# EAGLE schematic dsp (EAGLE 6.6.0)

## Sheet 1 of 2
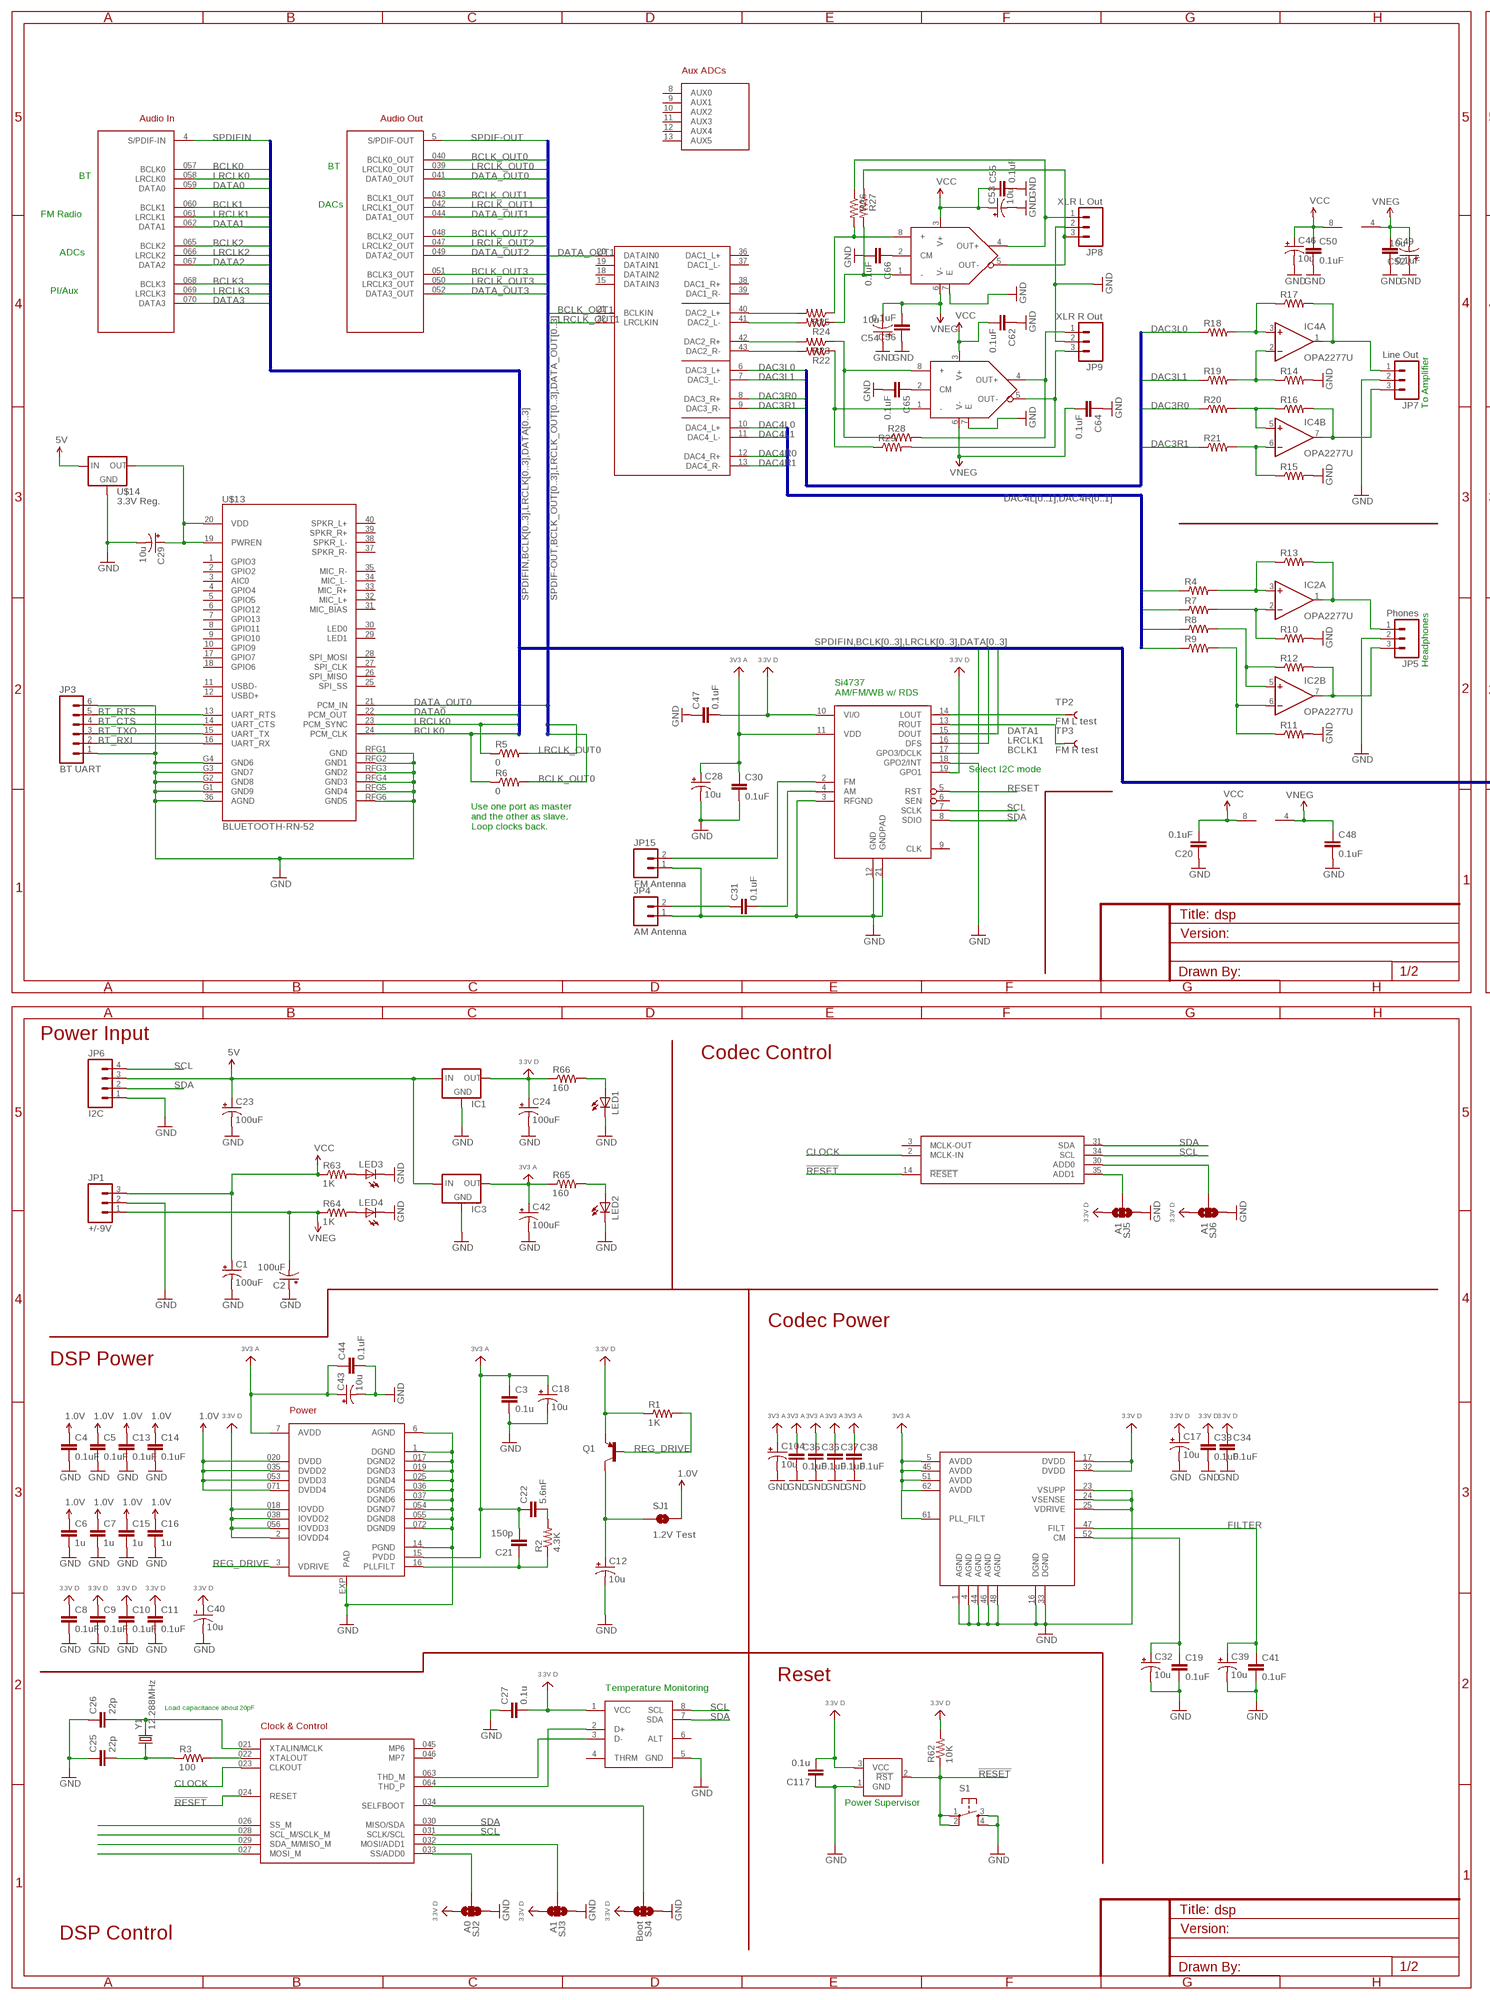
[diagram p0: schematic, sheet 1, part 1 of 2]
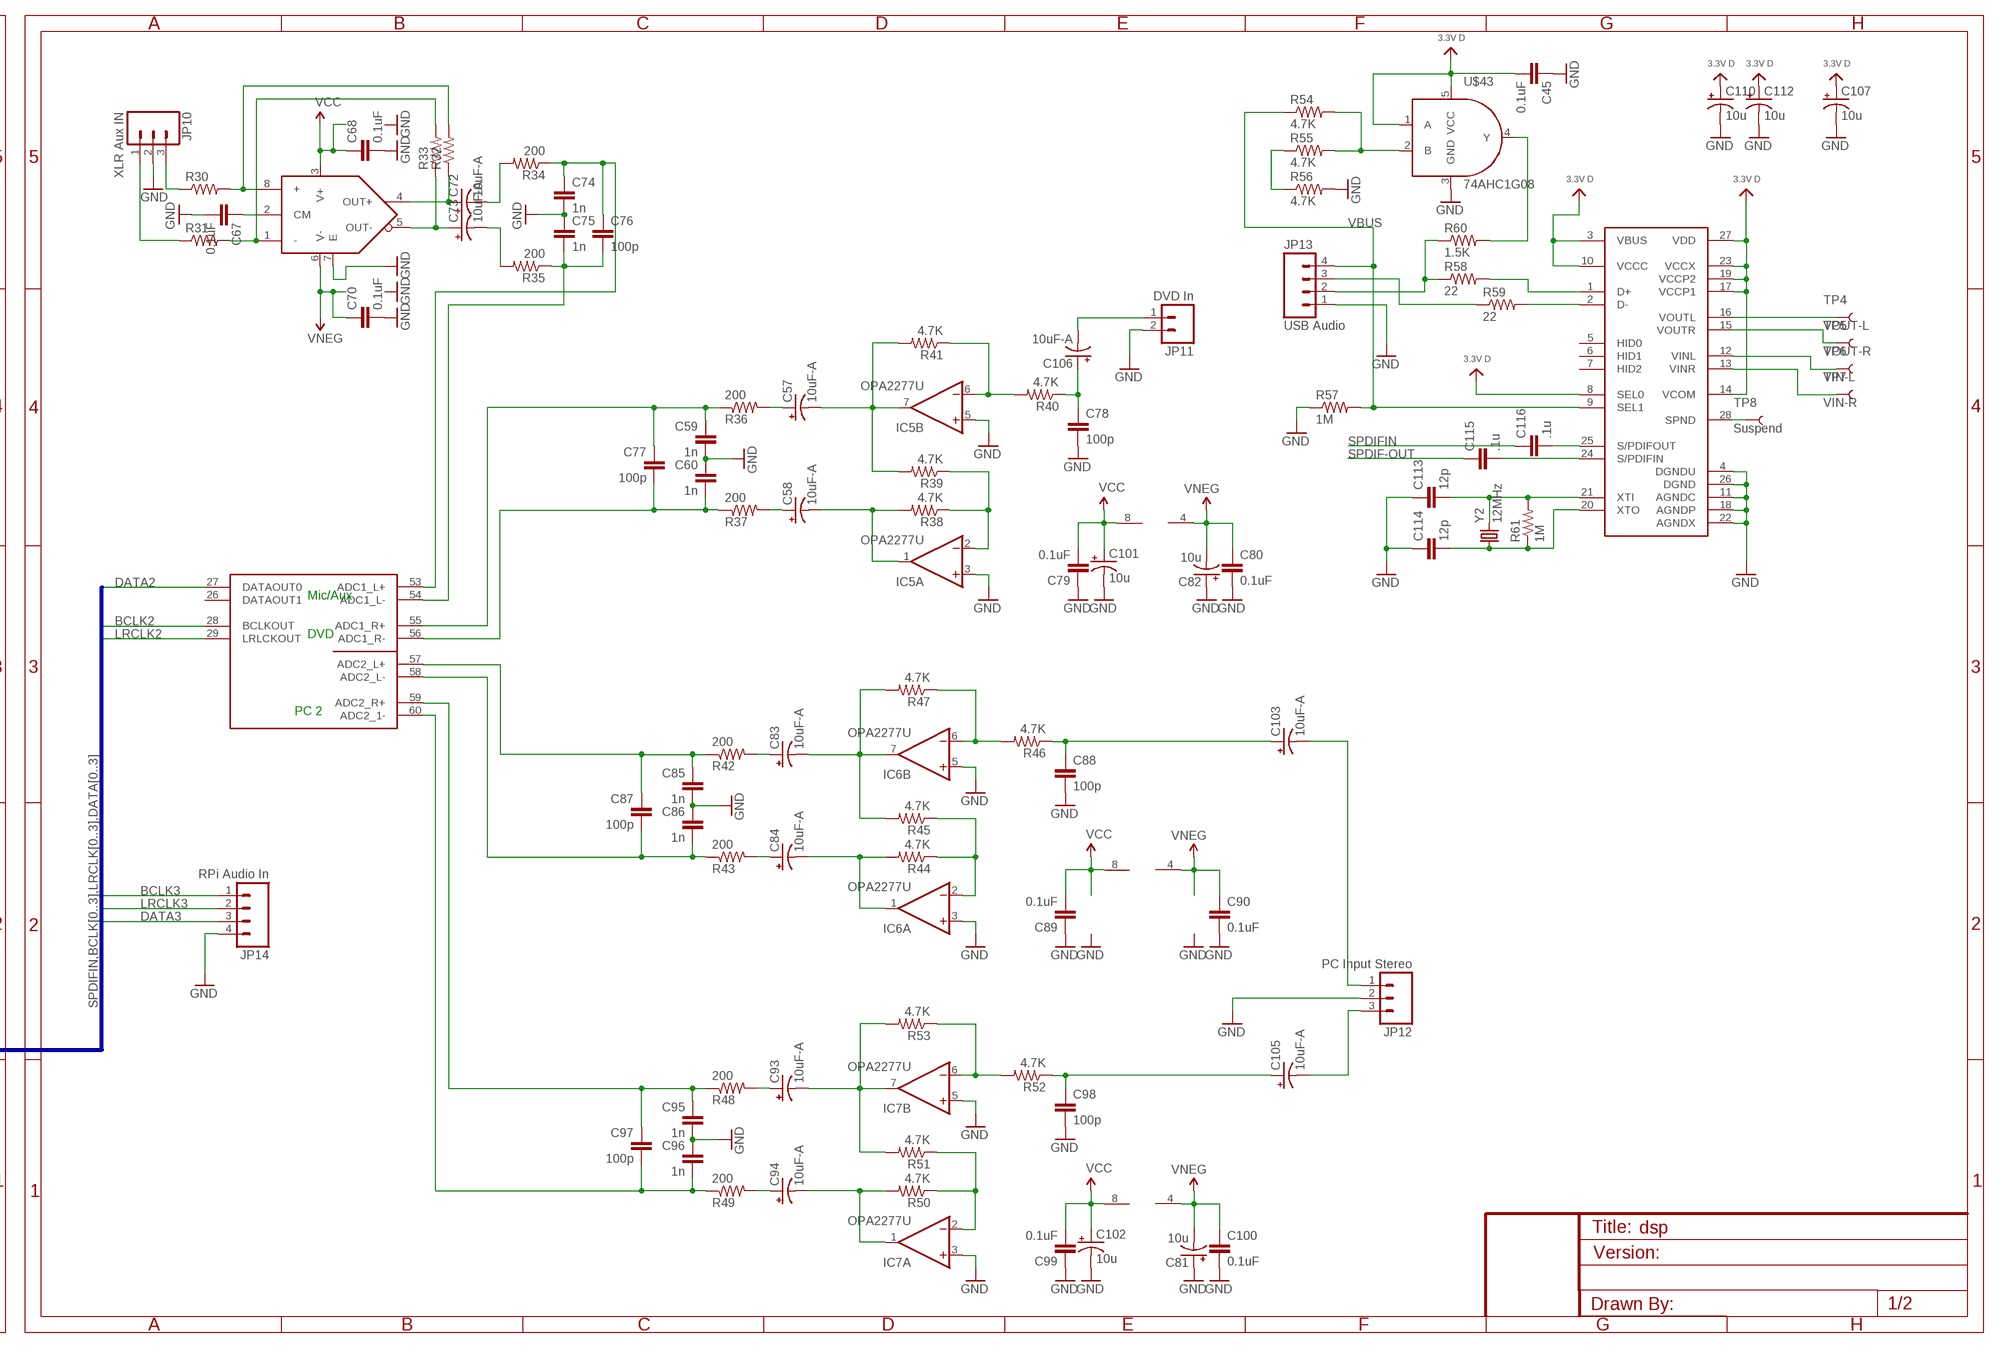
[diagram p1: schematic, sheet 1, part 2 of 2]

### Parts
C1  100uF  CAP_POLPTH1  [CPOL-RADIAL-100UF-25V]
C2  100uF  CAP_POLPTH1  [CPOL-RADIAL-100UF-25V]
C3  0.1u  CAP0603-CAP  [0603-CAP]
C4  0.1uF  CAP0603-CAP  [0603-CAP]
C5  0.1uF  CAP0603-CAP  [0603-CAP]
C6  1u  CAP0603-CAP  [0603-CAP]
C7  1u  CAP0603-CAP  [0603-CAP]
C8  0.1uF  CAP0603-CAP  [0603-CAP]
C9  0.1uF  CAP0603-CAP  [0603-CAP]
C10  0.1uF  CAP0603-CAP  [0603-CAP]
C11  0.1uF  CAP0603-CAP  [0603-CAP]
C12  10u  CPOL-USB  [PANASONIC_B]
C13  0.1uF  CAP0603-CAP  [0603-CAP]
C14  0.1uF  CAP0603-CAP  [0603-CAP]
C15  1u  CAP0603-CAP  [0603-CAP]
C16  1u  CAP0603-CAP  [0603-CAP]
C17  10u  CPOL-USB  [PANASONIC_B]
C18  10u  CPOL-USB  [PANASONIC_B]
C19  0.1uF  CAP0603-CAP  [0603-CAP]
C20  0.1uF  CAP0603-CAP  [0603-CAP]
C21  150p  CAP0603-CAP  [0603-CAP]
C22  5.6nF  CAP0603-CAP  [0603-CAP]
C23  100uF  CAP_POLPTH1  [CPOL-RADIAL-100UF-25V]
C24  100uF  CAP_POLPTH1  [CPOL-RADIAL-100UF-25V]
C25  22p  CAP0603-CAP  [0603-CAP]
C26  22p  CAP0603-CAP  [0603-CAP]
C27  0.1u  CAP0603-CAP  [0603-CAP]
C28  10u  CPOL-USB  [PANASONIC_B]
C29  10u  CPOL-USB  [PANASONIC_B]
C30  0.1uF  CAP0603-CAP  [0603-CAP]
C31  0.1uF  CAP0603-CAP  [0603-CAP]
C32  10u  CPOL-USB  [PANASONIC_B]
C33  0.1uF  CAP0603-CAP  [0603-CAP]
C34  0.1uF  CAP0603-CAP  [0603-CAP]
C35  0.1uF  CAP0603-CAP  [0603-CAP]
C36  0.1uF  CAP0603-CAP  [0603-CAP]
C37  0.1uF  CAP0603-CAP  [0603-CAP]
C38  0.1uF  CAP0603-CAP  [0603-CAP]
C39  10u  CPOL-USB  [PANASONIC_B]
C40  10u  CPOL-USB  [PANASONIC_B]
C41  0.1uF  CAP0603-CAP  [0603-CAP]
C42  100uF  CAP_POLPTH1  [CPOL-RADIAL-100UF-25V]
C43  10u  CPOL-USB  [PANASONIC_B]
C44  0.1uF  CAP0603-CAP  [0603-CAP]
C45  0.1uF  CAP0603-CAP  [0603-CAP]
C46  10u  CPOL-USB  [PANASONIC_B]
C47  0.1uF  CAP0603-CAP  [0603-CAP]
C48  0.1uF  CAP0603-CAP  [0603-CAP]
C49  0.1uF  CAP0603-CAP  [0603-CAP]
C50  0.1uF  CAP0603-CAP  [0603-CAP]
C52  10u  CPOL-USB  [PANASONIC_B]
C53  10u  CPOL-USB  [PANASONIC_B]
C54  10u  CPOL-USB  [PANASONIC_B]
C55  0.1uF  CAP0603-CAP  [0603-CAP]
C56  0.1uF  CAP0603-CAP  [0603-CAP]
C57  10uF-A  CAP_POLC  [PANASONIC_C]
C58  10uF-A  CAP_POLC  [PANASONIC_C]
C59  1n  CAP0603-CAP  [0603-CAP]
C60  1n  CAP0603-CAP  [0603-CAP]
C62  0.1uF  CAP0603-CAP  [0603-CAP]
C64  0.1uF  CAP0603-CAP  [0603-CAP]
C65  0.1uF  CAP0603-CAP  [0603-CAP]
C66  0.1uF  CAP0603-CAP  [0603-CAP]
C67  0.1uF  CAP0603-CAP  [0603-CAP]
C68  0.1uF  CAP0603-CAP  [0603-CAP]
C70  0.1uF  CAP0603-CAP  [0603-CAP]
C72  10uF-A  CAP_POLC  [PANASONIC_C]
C73  10uF-A  CAP_POLC  [PANASONIC_C]
C74  1n  CAP0603-CAP  [0603-CAP]
C75  1n  CAP0603-CAP  [0603-CAP]
C76  100p  CAP0603-CAP  [0603-CAP]
C77  100p  CAP0603-CAP  [0603-CAP]
C78  100p  CAP0603-CAP  [0603-CAP]
C79  0.1uF  CAP0603-CAP  [0603-CAP]
C80  0.1uF  CAP0603-CAP  [0603-CAP]
C81  10u  CPOL-USB  [PANASONIC_B]
C82  10u  CPOL-USB  [PANASONIC_B]
C83  10uF-A  CAP_POLC  [PANASONIC_C]
C84  10uF-A  CAP_POLC  [PANASONIC_C]
C85  1n  CAP0603-CAP  [0603-CAP]
C86  1n  CAP0603-CAP  [0603-CAP]
C87  100p  CAP0603-CAP  [0603-CAP]
C88  100p  CAP0603-CAP  [0603-CAP]
C89  0.1uF  CAP0603-CAP  [0603-CAP]
C90  0.1uF  CAP0603-CAP  [0603-CAP]
C93  10uF-A  CAP_POLC  [PANASONIC_C]
C94  10uF-A  CAP_POLC  [PANASONIC_C]
C95  1n  CAP0603-CAP  [0603-CAP]
C96  1n  CAP0603-CAP  [0603-CAP]
C97  100p  CAP0603-CAP  [0603-CAP]
C98  100p  CAP0603-CAP  [0603-CAP]
C99  0.1uF  CAP0603-CAP  [0603-CAP]
C100  0.1uF  CAP0603-CAP  [0603-CAP]
C101  10u  CPOL-USB  [PANASONIC_B]
C102  10u  CPOL-USB  [PANASONIC_B]
C103  10uF-A  CAP_POLC  [PANASONIC_C]
C104  10u  CPOL-USB  [PANASONIC_B]
C105  10uF-A  CAP_POLC  [PANASONIC_C]
C106  10uF-A  CAP_POLC  [PANASONIC_C]
C107  10u  CPOL-USB  [PANASONIC_B]
C110  10u  CPOL-USB  [PANASONIC_B]
C112  10u  CPOL-USB  [PANASONIC_B]
C113  12p  CAP0603-CAP  [0603-CAP]
C114  12p  CAP0603-CAP  [0603-CAP]
C115  .1u  CAP0603-CAP  [0603-CAP]
C116  .1u  CAP0603-CAP  [0603-CAP]
C117  0.1u  CAP0603-CAP  [0603-CAP]
IC1  V_REG_78XXSINK  [TO220-IGO]
IC2  OPA2277U  [SO08]
IC3  V_REG_78XXSINK  [TO220-IGO]
IC4  OPA2277U  [SO08]
IC5  OPA2277U  [SO08]
IC6  OPA2277U  [SO08]
IC7  OPA2277U  [SO08]
JP1  +/-9V  M03POLAR  [MOLEX-1X3]
JP3  BT UART  M06POLAR  [MOLEX-1X6]
JP4  AM Antenna  M02PTH  [1X02]
JP5  Phones  M03POLAR  [MOLEX-1X3]
JP6  I2C  M04POLAR  [MOLEX-1X4]
JP7  Line Out  M03POLAR  [MOLEX-1X3]
JP8  XLR L Out  M03POLAR  [MOLEX-1X3]
JP9  XLR R Out  M03POLAR  [MOLEX-1X3]
JP10  XLR Aux IN  M03POLAR  [MOLEX-1X3]
JP11  DVD In  M02POLAR  [MOLEX-1X2]
JP12  PC Input Stereo  M03POLAR  [MOLEX-1X3]
JP13  USB Audio  M04POLAR  [MOLEX-1X4]
JP14  RPi Audio In  M04POLAR  [MOLEX-1X4]
JP15  FM Antenna  M02PTH  [1X02]
LED1  LED1206  [LED-1206]
LED2  LED1206  [LED-1206]
LED3  LED1206  [LED-1206]
LED4  LED1206  [LED-1206]
Q1  TRANSISTOR_PNPSMD  [SOT23-3]
R1  1K  RESISTOR1206  [1206]
R2  4.3K  RESISTOR1206  [1206]
R3  100  RESISTOR1206  [1206]
R4  RESISTOR1206  [1206]
R5  0  RESISTOR1206  [1206]
R6  0  RESISTOR1206  [1206]
R7  RESISTOR1206  [1206]
R8  RESISTOR1206  [1206]
R9  RESISTOR1206  [1206]
R10  RESISTOR1206  [1206]
R11  RESISTOR1206  [1206]
R12  RESISTOR1206  [1206]
R13  RESISTOR1206  [1206]
R14  RESISTOR1206  [1206]
R15  RESISTOR1206  [1206]
R16  RESISTOR1206  [1206]
R17  RESISTOR1206  [1206]
R18  RESISTOR1206  [1206]
R19  RESISTOR1206  [1206]
R20  RESISTOR1206  [1206]
R21  RESISTOR1206  [1206]
R22  RESISTOR1206  [1206]
R23  RESISTOR1206  [1206]
R24  RESISTOR1206  [1206]
R25  RESISTOR1206  [1206]
R26  RESISTOR1206  [1206]
R27  RESISTOR1206  [1206]
R28  RESISTOR1206  [1206]
R29  RESISTOR1206  [1206]
R30  RESISTOR1206  [1206]
R31  RESISTOR1206  [1206]
R32  RESISTOR1206  [1206]
R33  RESISTOR1206  [1206]
R34  200  RESISTOR1206  [1206]
R35  200  RESISTOR1206  [1206]
R36  200  RESISTOR1206  [1206]
R37  200  RESISTOR1206  [1206]
R38  4.7K  RESISTOR1206  [1206]
R39  4.7K  RESISTOR1206  [1206]
R40  4.7K  RESISTOR1206  [1206]
R41  4.7K  RESISTOR1206  [1206]
R42  200  RESISTOR1206  [1206]
R43  200  RESISTOR1206  [1206]
R44  4.7K  RESISTOR1206  [1206]
R45  4.7K  RESISTOR1206  [1206]
R46  4.7K  RESISTOR1206  [1206]
R47  4.7K  RESISTOR1206  [1206]
R48  200  RESISTOR1206  [1206]
R49  200  RESISTOR1206  [1206]
R50  4.7K  RESISTOR1206  [1206]
R51  4.7K  RESISTOR1206  [1206]
R52  4.7K  RESISTOR1206  [1206]
R53  4.7K  RESISTOR1206  [1206]
R54  4.7K  RESISTOR1206  [1206]
R55  4.7K  RESISTOR1206  [1206]
R56  4.7K  RESISTOR1206  [1206]
R57  1M  RESISTOR1206  [1206]
R58  22  RESISTOR1206  [1206]
R59  22  RESISTOR1206  [1206]
R60  1.5K  RESISTOR1206  [1206]
R61  1M  RESISTOR1206  [1206]
R62  10K  RESISTOR1206  [1206]
R63  1K  RESISTOR1206  [1206]
R64  1K  RESISTOR1206  [1206]
R65  160  RESISTOR1206  [1206]
R66  160  RESISTOR1206  [1206]
S1  TAC_SWITCHPTH  [TACTILE-PTH]
SJ1  1.2V Test  SOLDERJUMPERNO  [SJ_2S-NO]
SJ2  A0  SOLDERJUMPER_2WAYS  [SJ_3]
SJ3  A1  SOLDERJUMPER_2WAYS  [SJ_3]
SJ4  Boot  SOLDERJUMPER_2WAYS  [SJ_3]
SJ5  A1  SOLDERJUMPER_2WAYS  [SJ_3]
SJ6  A1  SOLDERJUMPER_2WAYS  [SJ_3]
TP2  FM L test  TEST-POINT3  [PAD.03X.03]
TP3  FM R test  TEST-POINT3  [PAD.03X.03]
TP4  VOUT-L  TEST-POINT3  [PAD.03X.03]
TP5  VOUT-R  TEST-POINT3  [PAD.03X.03]
TP6  VIN-L  TEST-POINT3  [PAD.03X.03]
TP7  VIN-R  TEST-POINT3  [PAD.03X.03]
TP8  Suspend  TEST-POINT3  [PAD.03X.03]
U$1  ADAU1451  [LFCSP-72]
U$8  ADM1032  [MSOP-8]
U$13  BLUETOOTH-RN-52  [RN-52]
U$14  3.3V Reg.  V_REG_MIC2920  [SOT223]
U$15  SI4736/37/38/39  [QFN-16]
U$17  AD1937  [LQFP-64]
U$35  LME49724  [SOIC-8]
U$38  LME49724  [SOIC-8]
U$39  LME49724  [SOIC-8]
U$40  PCM2903  [SSOP-28]
U$43  74AHC1G08  [SOT23-5]
U$52  TLV803  [SOT23]
Y1  12.288MHz  CRYSTALHC49UV  [HC49U-V]
Y2  12MHz  CRYSTALHC49UV  [HC49U-V]

### Nets
1.0V: C4.1 C5.1 C6.1 C7.1 C13.1 C14.1 C15.1 C16.1 SJ1.2 U$1.020(DVDD) U$1.035(DVDD2) U$1.053(DVDD3) U$1.071(DVDD4)
3.3V_A: C3.1 C18.+ C21.2 C22.1 C28.+ C30.1 C35.1 C36.1 C37.1 C38.1 C42.1(+) C43.+ C44.1 C104.+ IC3.OUT R65.1 U$1.7(AVDD) U$1.15(PVDD) U$15.11(VDD) U$17.5(AVDD) U$17.45(AVDD) U$17.51(AVDD) U$17.61(PLL_FILT) U$17.62(AVDD)
3V3_D: C8.1 C9.1 C10.1 C11.1 C17.+ C24.1(+) C27.2 C33.1 C34.1 C40.+ C45.2 C47.2 C107.+ C110.+ C112.+ C117.2 IC1.OUT Q1.2(E) R1.1 R62.2 R66.1 SJ2.3 SJ3.3 SJ4.3 SJ5.3 SJ6.3 U$1.2(IOVDD4) U$1.018(IOVDD) U$1.038(IOVDD2) U$1.056(IOVDD3) U$8.1(VCC) U$15.10(VI/O) U$15.19(GPO1) U$17.17(DVDD) U$17.32(DVDD) U$40.3(VBUS) U$40.8(SEL0) U$40.10(VCCC) U$40.14(VCOM) U$40.17(VCCP1) U$40.19(VCCP2) U$40.23(VCCX) U$40.27(VDD) U$43.1(A) U$43.5(VCC) U$52.3(VCC) ; supply symbol labelled 3.3V_D
5V: C23.1(+) IC1.IN IC3.IN JP6.3 U$14.1(IN)
!RESET: R62.1 S1.1 S1.2 U$1.024(RESET) U$17.14(!RESET) U$52.2(!RST)
BCLK0: R6.1 U$1.057(BCLK0) U$13.24(PCM_CLK)
BCLK1: U$1.060(BCLK1) U$15.17(GPO3/DCLK)
BCLK2: U$1.065(BCLK2) U$17.28(BCLKOUT)
BCLK3: JP14.1 U$1.068(BCLK3)
BCLK_OUT0: R6.2 U$1.040(BCLK0_OUT)
BCLK_OUT1: U$1.043(BCLK1_OUT) U$17.21(BCLKIN)
BCLK_OUT2: U$1.048(BCLK2_OUT)
BCLK_OUT3: U$1.051(BCLK3_OUT)
BT_CTS: JP3.4 U$13.14(UART_CTS)
BT_RTS: JP3.5 U$13.13(UART_RTS)
BT_RXI: JP3.2 U$13.16(UART_RX)
BT_TXO: JP3.3 U$13.15(UART_TX)
CLOCK: U$1.023(CLKOUT) U$17.2(MCLK-IN)
DAC3L0: R18.1 U$17.6(DAC3_L+)
DAC3L1: R19.1 U$17.7(DAC3_L-)
DAC3R0: R20.1 U$17.8(DAC3_R+)
DAC3R1: R21.1 U$17.9(DAC3_R-)
DAC4L0: R4.1 U$17.10(DAC4_L+)
DAC4L1: R7.1 U$17.11(DAC4_L-)
DAC4R0: R8.1 U$17.12(DAC4_R+)
DAC4R1: R9.1 U$17.13(DAC4_R-)
DATA0: U$1.059(DATA0) U$13.22(PCM_OUT)
DATA1: U$1.062(DATA1) U$15.15(DOUT)
DATA2: U$1.067(DATA2) U$17.27(DATAOUT0)
DATA3: JP14.3 U$1.070(DATA3)
DATA_OUT0: U$1.041(DATA0_OUT) U$13.21(PCM_IN)
DATA_OUT1: U$1.044(DATA1_OUT) U$17.20(DATAIN0)
DATA_OUT2: U$1.049(DATA2_OUT)
DATA_OUT3: U$1.052(DATA3_OUT)
FILTER: C39.+ C41.1 U$17.47(FILT)
FM: JP15.2 U$15.2(FM)
GND: C1.2(-) C2.1(+) C3.2 C4.2 C5.2 C6.2 C7.2 C8.2 C9.2 C10.2 C11.2 C12.- C13.2 C14.2 C15.2 C16.2 C17.- C18.- C19.2 C20.1 C23.2(-) C24.2(-) C25.1 C26.1 C27.1 C28.- C29.- C30.2 C32.- C33.2 C34.2 C35.2 C36.2 C37.2 C38.2 C39.- C40.- C41.2 C42.2(-) C43.- C44.2 C45.1 C46.- C47.1 C48.2 C49.2 C50.2 C52.+ C53.- C54.+ C55.2 C56.1 C59.2 C60.1 C62.1 C64.1 C65.2 C66.2 C67.2 C68.2 C70.2 C74.2 C75.1 C78.2 C79.1 C80.2 C81.+ C82.+ C85.2 C86.1 C88.2 C89.1 C90.2 C95.2 C96.1 C98.2 C99.1 C100.2 C101.- C102.- C104.- C107.- C110.- C112.- C113.1 C114.1 C117.1 IC1.GND IC3.GND IC5.3(A:+IN) IC5.5(B:+IN) IC6.3(A:+IN) IC6.5(B:+IN) IC7.3(A:+IN) IC7.5(B:+IN) JP1.2 JP3.1 JP3.6 JP4.1 JP5.2 JP6.1 JP7.2 JP8.2 JP9.2 JP10.2 JP11.2 JP12.2 JP13.1 JP14.4 JP15.1 LED1.C LED2.C LED3.C LED4.C R10.2 R11.2 R14.2 R15.2 R56.2 R57.1 S1.3 S1.4 SJ2.1 SJ3.1 SJ4.1 SJ5.1 SJ6.1 U$1.1(DGND) U$1.6(AGND) U$1.14(PGND) U$1.017(DGND2) U$1.019(DGND3) U$1.025(DGND4) U$1.036(DGND5) U$1.037(DGND6) U$1.054(DGND7) U$1.055(DGND8) U$1.072(DGND9) U$1.EXP(PAD) U$8.5(GND) U$13.36(AGND) U$13.G1(GND9) U$13.G2(GND8) U$13.G3(GND7) U$13.G4(GND6) U$13.RFG1(GND) U$13.RFG2(GND1) U$13.RFG3(GND2) U$13.RFG4(GND3) U$13.RFG5(GND4) U$13.RFG6(GND5) U$14.2(GND) U$15.3(RFGND) U$15.12(GND) U$15.18(GPO2/INT) U$15.21(GNDPAD) U$17.1(AGND) U$17.4(AGND) U$17.16(DGND) U$17.23(VSUPP) U$17.24(VSENSE) U$17.25(VDRIVE) U$17.33(DGND) U$17.44(AGND) U$17.46(AGND) U$17.48(AGND) U$35.7(E) U$38.7(E) U$39.7(E) U$40.4(DGNDU) U$40.11(AGNDC) U$40.18(AGNDP) U$40.22(AGNDX) U$40.26(DGND) U$43.3(GND) U$52.1(GND)
LRCLK0: R5.1 U$1.058(LRCLK0) U$13.23(PCM_SYNC)
LRCLK1: U$1.061(LRCLK1) U$15.16(DFS)
LRCLK2: U$1.066(LRCLK2) U$17.29(LRLCKOUT)
LRCLK3: JP14.2 U$1.069(LRCLK3)
LRCLK_OUT0: R5.2 U$1.039(LRCLK0_OUT)
LRCLK_OUT1: U$1.042(LRCLK1_OUT) U$17.22(LRCLKIN)
LRCLK_OUT2: U$1.047(LRCLK2_OUT)
LRCLK_OUT3: U$1.050(LRCLK3_OUT)
N$1: C21.1 R2.1 U$1.16(PLLFILT)
N$2: C22.2 R2.2
N$3: R3.2 U$1.022(XTALOUT)
N$4: C12.+ Q1.3(C) SJ1.1
N$5: C26.2 U$1.021(XTALIN/MCLK) Y1.2
N$6: C25.2 R3.1 Y1.1
N$7: C19.1 C32.+ U$17.52(CM)
N$8: U$1.063(THD_M) U$8.3(D-)
N$9: U$1.064(THD_P) U$8.2(D+)
N$10: SJ4.2 U$1.034(SELFBOOT)
N$11: U$1.027(MOSI_M)
N$12: SJ3.2 U$1.032(MOSI/ADD1)
N$13: SJ2.2 U$1.033(SS/ADD0)
N$14: U$1.029(SDA_M/MISO_M)
N$15: U$1.028(SCL_M/SCLK_M)
N$16: U$1.026(SS_M)
N$17: C29.+ U$13.19(PWREN) U$13.20(VDD) U$14.3(OUT)
N$18: IC2.1(A:OUT) JP5.1 R13.2
N$19: IC2.3(A:+IN) R4.2 R13.1
N$20: C31.2 U$15.4(AM)
N$21: C31.1 JP4.2
N$22: TP2.P$1 U$15.14(LOUT)
N$23: TP3.P$1 U$15.13(ROUT)
N$25: IC2.2(A:-IN) R7.2 R10.1
N$26: SJ5.2 U$17.35(ADD1)
N$27: SJ6.2 U$17.30(ADD0)
N$28: IC2.5(B:+IN) R8.2 R12.1
N$29: IC2.6(B:-IN) R9.2 R11.1
N$30: IC4.7(B:OUT) JP7.3 R16.2
N$31: IC4.1(A:OUT) JP7.1 R17.2
N$32: IC2.7(B:OUT) JP5.3 R12.2
N$33: IC4.3(A:+IN) R17.1 R18.2
N$34: IC4.2(A:-IN) R14.1 R19.2
N$35: IC4.5(B:+IN) R16.1 R20.2
N$36: IC4.6(B:-IN) R15.1 R21.2
N$37: C73.+ R33.1 U$39.5(OUT-)
N$38: JP9.1 R28.2 U$38.4(OUT+)
N$39: JP9.3 R29.2 U$38.5(OUT-)
N$40: JP8.1 R26.1 U$35.4(OUT+)
N$41: JP8.3 R27.1 U$35.5(OUT-)
N$42: R24.2 U$17.41(DAC2_L-)
N$43: C66.1 U$35.2(CM)
N$44: C65.1 U$38.2(CM)
N$45: R25.2 U$17.40(DAC2_L+)
N$46: R23.2 U$17.42(DAC2_R+)
N$47: R22.2 U$17.43(DAC2_R-)
N$48: C72.+ R32.1 U$39.4(OUT+)
N$49: R25.1 R26.2 U$35.8(+)
N$50: R24.1 R27.2 U$35.1(-)
N$51: R23.1 R28.1 U$38.8(+)
N$52: R22.1 R29.1 U$38.1(-)
N$53: C67.1 U$39.2(CM)
N$54: C72.- R34.2
N$55: C73.- R35.2
N$56: C57.+ R36.2
N$57: R30.2 R32.2 U$39.8(+)
N$58: JP10.3 R30.1
N$59: JP10.1 R31.1
N$60: R31.2 R33.2 U$39.1(-)
N$61: C75.2 C76.2 R35.1 U$17.54(ADC1_L-)
N$62: C58.+ R37.2
N$63: C74.1 C76.1 R34.1 U$17.53(ADC1_L+)
N$64: C60.2 C77.2 R37.1 U$17.56(ADC1_R-)
N$65: C59.1 C77.1 R36.1 U$17.55(ADC1_R+)
N$66: C58.- IC5.1(A:OUT) R38.2
N$67: C57.- IC5.7(B:OUT) R39.2 R41.2
N$68: IC5.2(A:-IN) R38.1 R39.1
N$69: IC5.6(B:-IN) R40.2 R41.1
N$70: C106.- JP11.1
N$71: C83.+ R42.2
N$72: C86.2 C87.2 R43.1 U$17.58(ADC2_L-)
N$73: C85.1 C87.1 R42.1 U$17.57(ADC2_L+)
N$74: C84.+ R43.2
N$75: C83.- IC6.7(B:OUT) R45.2 R47.2
N$76: C84.- IC6.1(A:OUT) R44.2
N$77: IC6.2(A:-IN) R44.1 R45.1
N$78: IC6.6(B:-IN) R46.2 R47.1
N$79: C88.1 C103.+ R46.1
N$80: C93.+ R48.2
N$81: C96.2 C97.2 R49.1 U$17.60(ADC2_1-)
N$82: C95.1 C97.1 R48.1 U$17.59(ADC2_R+)
N$83: C94.+ R49.2
N$84: C93.- IC7.7(B:OUT) R51.2 R53.2
N$85: C94.- IC7.1(A:OUT) R50.2
N$86: IC7.2(A:-IN) R50.1 R51.1
N$87: IC7.6(B:-IN) R52.2 R53.1
N$88: C98.1 C105.+ R52.1
N$89: C103.- JP12.1
N$91: C105.- JP12.3
N$92: C78.1 C106.+ R40.1
N$93: TP4.P$1 U$40.16(VOUTL)
N$94: TP5.P$1 U$40.15(VOUTR)
N$95: TP6.P$1 U$40.12(VINL)
N$96: TP7.P$1 U$40.13(VINR)
N$97: JP13.2 R58.1 R60.1
N$98: R58.2 U$40.1(D+)
N$99: R54.2 R55.2 U$43.2(B)
N$100: R59.2 U$40.2(D-)
N$101: R55.1 R56.1
N$102: JP13.3 R59.1
N$103: R60.2 U$43.4(Y)
N$104: C113.2 R61.2 U$40.21(XTI) Y2.2
N$105: TP8.P$1 U$40.28(SPND)
N$106: C114.2 R61.1 U$40.20(XTO) Y2.1
N$107: C115.2 U$40.24(S/PDIFIN)
N$108: C116.2 U$40.25(S/PDIFOUT)
N$110: LED3.A R63.2
N$111: LED4.A R64.2
N$112: LED1.A R66.2
N$113: LED2.A R65.2
REG_DRIVE: Q1.1(B) R1.2 U$1.3(VDRIVE)
RESET: U$15.5(RST)
SCL: JP6.4 U$1.031(SCLK/SCL) U$8.8(SCL) U$15.7(SCLK) U$17.34(SCL)
SDA: JP6.2 U$1.030(MISO/SDA) U$8.7(SDA) U$15.8(SDIO) U$17.31(SDA)
SPDIF-OUT: C115.1 U$1.5(S/PDIF-OUT)
SPDIFIN: C116.1 U$1.4(S/PDIF-IN)
VBUS: JP13.4 R54.1 R57.2 U$40.9(SEL1)
VCC: C1.1(+) C20.2 C46.+ C50.1 C53.+ C55.1 C62.2 C68.1 C79.2 C89.2 C99.2 C101.+ C102.+ IC2.8(P:V+) IC4.8(P:V+) IC5.8(P:V+) IC6.8(P:V+) IC7.8(P:V+) JP1.3 R63.1 U$35.3(V+) U$38.3(V+) U$39.3(V+)
VNEG: C2.2(-) C48.1 C49.1 C52.- C54.- C56.2 C64.2 C70.1 C80.1 C81.- C82.- C90.1 C100.1 IC2.4(P:V-) IC4.4(P:V-) IC5.4(P:V-) IC6.4(P:V-) IC7.4(P:V-) JP1.1 R64.1 U$35.6(V-) U$38.6(V-) U$39.6(V-)
Unconnected: U$1.8(AUX0) U$1.9(AUX1) U$1.10(AUX2) U$1.11(AUX3) U$1.12(AUX4) U$1.13(AUX5) U$1.045(MP6) U$1.046(MP7) U$8.4(THRM) U$8.6(ALT) U$13.1(GPIO3) U$13.2(GPIO2) U$13.3(AIC0) U$13.4(GPIO4) U$13.5(GPIO5) U$13.6(GPIO12) U$13.7(GPIO13) U$13.8(GPIO11) U$13.9(GPIO10) U$13.10(GPIO9) U$13.11(USBD-) U$13.12(USBD+) U$13.17(GPIO7) U$13.18(GPIO6) U$13.25(SPI_SS) U$13.26(SPI_MISO) U$13.27(SPI_CLK) U$13.28(SPI_MOSI) U$13.29(LED1) U$13.30(LED0) U$13.31(MIC_BIAS) U$13.32(MIC_L+) U$13.33(MIC_R+) U$13.34(MIC_L-) U$13.35(MIC_R-) U$13.37(SPKR_R-) U$13.38(SPKR_L-) U$13.39(SPKR_R+) U$13.40(SPKR_L+) U$15.6(SEN) U$15.9(CLK) U$17.3(MCLK-OUT) U$17.15(DATAIN3) U$17.18(DATAIN2) U$17.19(DATAIN1) U$17.26(DATAOUT1) U$17.36(DAC1_L+) U$17.37(DAC1_L-) U$17.38(DAC1_R+) U$17.39(DAC1_R-) U$40.5(HID0) U$40.6(HID1) U$40.7(HID2)

### Buses
SPDIFIN,BCLK[0..3],LRCLK[0..3],DATA[0..3]
SPDIF-OUT,BCLK_OUT[0..3],LRCLK_OUT[0..3],DATA_OUT[0..3]
DAC4L[0..1],DAC4R[0..1]
DAC3L[0..1],DAC3R[0..1]

### Notes on the sheet
- BT
- BT
- DACs
- FM Radio
- ADCs
- PI/Aux
- To Amplifier
- Mic/Aux
- DVD
- PC 2
- Headphones
- Si4737
  AM/FM/WB w/ RDS
- Select I2C mode
- Use one port as master
  and the other as slave.
  Loop clocks back.
- Power Input
- Codec Control
- Codec Power
- DSP Power
- Reset
- Temperature Monitoring
- Load capacitance about 20pF
- Power Supervisor
- DSP Control

## Sheet 2 of 2

## Library data of the parts
C1 C2 C23 C24 C42 C57 C58 C72 C73 C83 C84 C93 C94 C103 C105 C106 = 1_SparkFun-Capacitors:CAP_POL: Capacitor Polarized These are standard SMD and PTH capacitors. Normally 10uF, 47uF, and 100uF in electrolytic and tantalum varieties. Always verify the external diameter of the through hole cap, it varies with capacity, voltage, and manufacturer. The EIA devices should be standard.
C3-C11 C13-C16 C19-C22 C25-C27 C30 C31 C33-C38 C41 C44 C45 C47-C50 C55 C56 C59 C60 C62 C64-C68 C70 C74-C80 C85-C90 C95-C100 C113-C117 = 1_SparkFun-Capacitors:CAP: Capacitor Standard 0603 ceramic capacitor, and 0.1" leaded capacitor.
C12 C17 C18 C28 C29 C32 C39 C40 C43 C46 C52-C54 C81 C82 C101 C102 C104 C107 C110 C112 = rcl:CPOL-US: POLARIZED CAPACITOR, American symbol
IC1 IC3 = 1_SparkFun-PowerIC:V_REG_78XX: Voltage Regulator Standard 7805 5V regulator. IGO (Input Ground Output). Spark Fun Electronics SKU : COM-00107
IC2 IC4-IC7 = linear:OPA2277: High Precision OPERATIONAL AMPLIFIERS REPLACES OP-07, OP-77, OP-177 Source: opa277.pdf
JP1 JP5 JP7-JP10 JP12 = 1_SparkFun-Connectors:M03: Header 3 Standard 3-pin 0.1" header. Use with straight break away headers (SKU : PRT-00116), right angle break away headers (PRT-00553), swiss pins (PRT-00743), machine pins (PRT-00117), and female headers (PRT-00115). Molex polarized connector foot print use with SKU : PRT-08232 with associated crimp pins and housings.
JP3 = 1_SparkFun-Connectors:M06: Header 6 Standard 6-pin 0.1" header. Use with straight break away headers (SKU : PRT-00116), right angle break away headers (PRT-00553), swiss pins (PRT-00743), machine pins (PRT-00117), and female headers (PRT-00115). Molex polarized connector foot print use with SKU : PRT-08094 with associated crimp pins and housings. NOTES ON THE VARIANTS LOCK and LOCK_LONGPADS... This footprint was designed to help hold the alignment of a through-hole component (i.e. 6-pin header) while soldering it into place. You may notice that each hole has been shifted either up or down by 0.005 of an inch from it's more standard position (which is a perfectly straight line). This slight alteration caused the pins (the squares in the middle) to touch the edges of the holes. Because they are alternating, it causes a "brace" to hold the component in place. 0.005 has proven to be the perfect amount of "off-center" position when using our standard breakaway headers. Although looks a little odd when you look at the bare footprint, once you have a header in there, the alteration is very hard to notice. Also,if you push a header all the way into place, it is covered up entirely on the bottom side. This idea of altering the position of holes to aid alignment will be further integrated into the Sparkfun Library for other footprints. It can help hold any component with 3 or more connection pins.
JP4 JP11 JP15 = 1_SparkFun-Connectors:M02: Standard 2-pin 0.1" header. Use with - straight break away headers ( PRT-00116) - right angle break away headers (PRT-00553) - swiss pins (PRT-00743) - machine pins (PRT-00117) - female headers (PRT-00115) Molex polarized connector foot print use with: PRT-08233 with associated crimp pins and housings. 2.54_SCREWTERM for use with PRT-10571. 3.5mm Screw Terminal footprints for PRT-08084 5mm Screw Terminal footprints for use with PRT-08433
JP6 JP13 JP14 = 1_SparkFun-Connectors:M04: Header 4 Standard 4-pin 0.1" header. Use with straight break away headers (SKU : PRT-00116), right angle break away headers (PRT-00553), swiss pins (PRT-00743), machine pins (PRT-00117), and female headers (PRT-00115). Molex polarized connector foot print use with SKU : PRT-08231 with associated crimp pins and housings. 1MM SMD Version SKU: PRT-10208
LED1-LED4 = 1_SparkFun-LED:LED: LEDs Standard schematic elements and footprints for 5mm, 3mm, 1206, and 0603 sized LEDs. 5mm - Spark Fun Electronics SKU : COM-00529 (and others)
Q1 = 1_SparkFun-DiscreteSemi:TRANSISTOR_PNP: Generic PNP BJT Double check pinouts against datasheets- not all devices are the same! MMBT3906 - 40V 200mA SOT-23 (TRANS-08052) MMBT4403 - 40V 600mA SOT-23 (TRANS-09245)
R1-R66 = 1_SparkFun-Resistors:RESISTOR: Resistor Basic schematic elements and footprints for 0603, 1206, and PTH resistors.
S1 = 1_SparkFun-Electromechanical:TAC_SWITCH: Momentary Switch Button commonly used for reset or general input. Spark Fun Electronics SKU : COM-00097 SMT- SWCH-08247
SJ1 = 1_SparkFun-Passives:SOLDERJUMPER: Solder Jumper Standard SMD solder jumper. Used to automate production. Two varients : Normally Open and Normally Closed are the same, but have different paste layers. NC will have a large amount of paste and should jumper during reflow.
SJ2-SJ6 = 1_SparkFun-Passives:SOLDERJUMPER_2WAY: Solder Jumper 2 way solder jumper
TP2-TP8 = 1_SparkFun-Passives:TEST-POINT: Bare copper test points for troubleshooting or ICT
U$1 = 0_DSP:ADAU1451
U$8 = 0_DSP:ADM1032
U$13 = 1_SparkFun-RF:BLUETOOTH-RN-52
U$14 = 1_SparkFun-PowerIC:V_REG_MIC2920: MIC2920A (http://www.micrel.com/_PDF/mic2920.pdf) - 400mA output LDO Regulator
U$15 = 0_Tristan's_Lib:SI4736/37/38/39
U$17 = 0_DSP:AD1937
U$35 U$38 U$39 = 0_DSP:LME49724
U$40 = 0_DSP:PCM2903
U$43 = 1_SparkFun-DigitalIC:74AHC1G08: Single 2-input AND gate
U$52 = 0_DSP:TLV803
Y1 Y2 = 1_SparkFun-FreqCtrl:CRYSTAL: Various standard crystals. Proven footprints. Spark Fun Electronics SKU : COM-00534